# Altium schematic sheet Audio.SchDoc: Audio
size A4; CompanyName: STMicroelectronics; Organization: Microcontrollers Division; DocumentNumber: 6; SheetNumber: 13; SheetTotal: 19
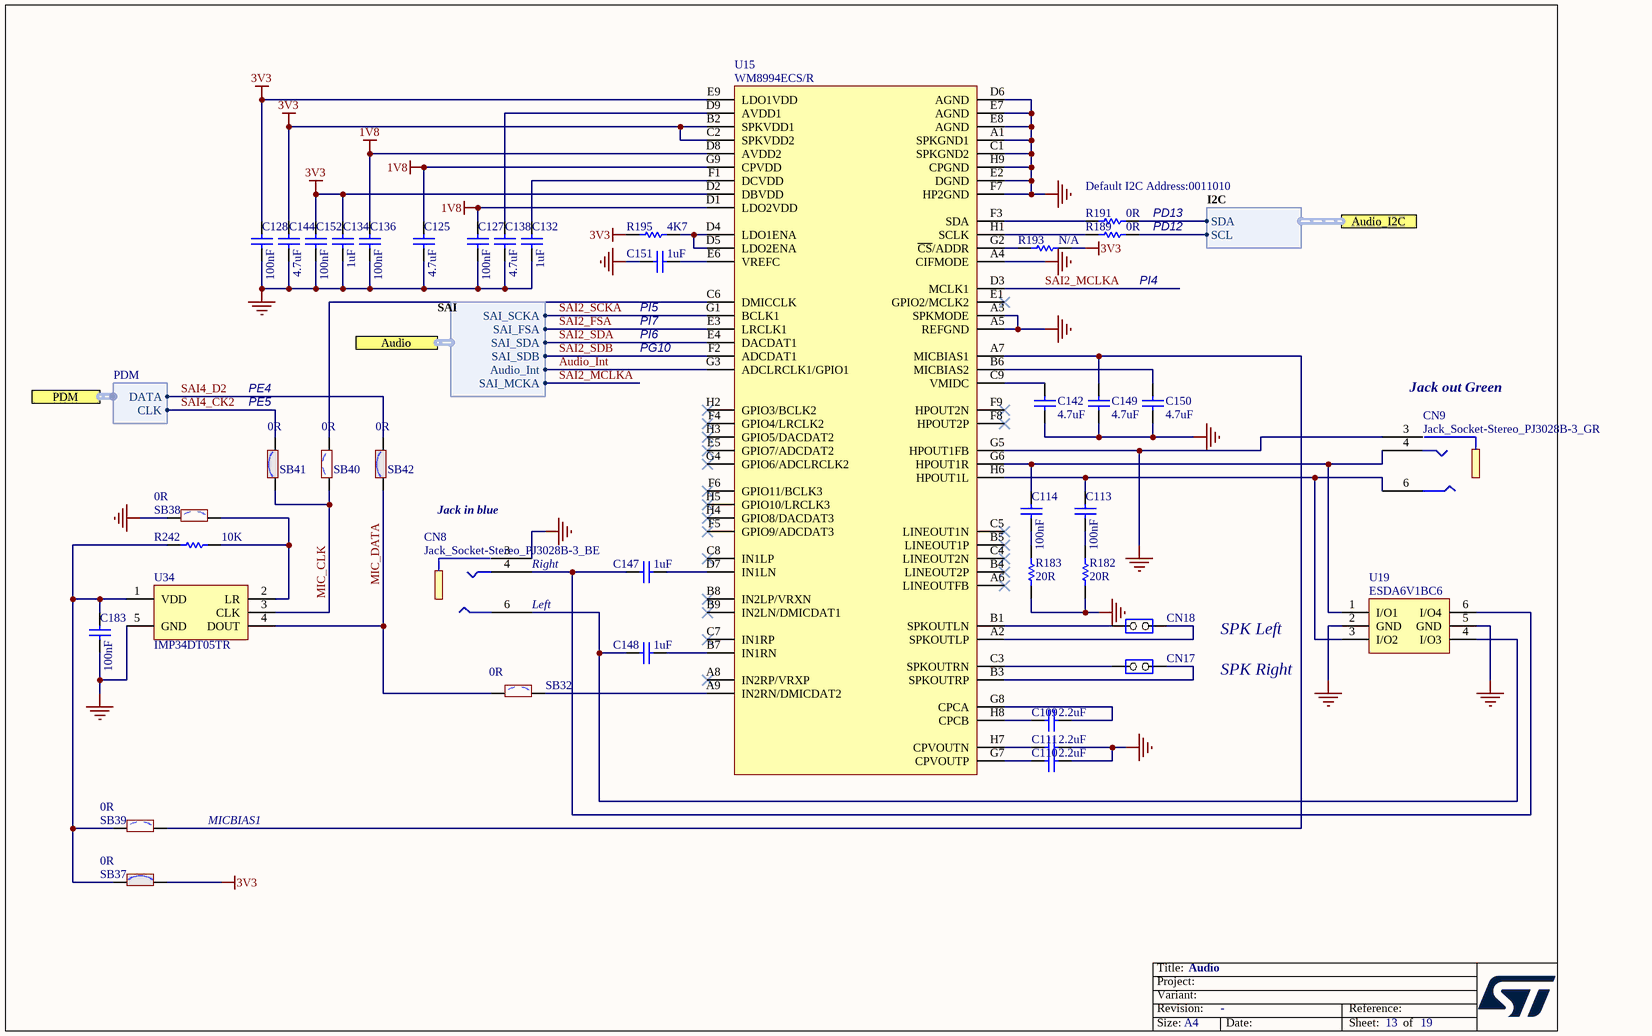
[diagram p0: Audio.SchDoc]

## Parts
C109  value 2.2uF  [C0603]  (hidden comment: Capacitor)
C110  value 2.2uF  [C0603]  (hidden comment: Capacitor)
C111  value 2.2uF  [C0603]  (hidden comment: Capacitor)
C113  value 100nF  [C0402]  (hidden comment: Capacitor)
C114  value 100nF  [C0402]  (hidden comment: Capacitor)
C125  value 4.7uF  [C0603]  (hidden comment: Capacitor)
C127  value 100nF  [C0402]  (hidden comment: Capacitor)
C128  value 100nF  [C0402]  (hidden comment: Capacitor)
C132  value 1uF  [C0603]  (hidden comment: Capacitor)
C134  value 1uF  [C0603]  (hidden comment: Capacitor)
C136  value 100nF  [C0402]  (hidden comment: Capacitor)
C138  value 4.7uF  [C0603]  (hidden comment: Capacitor)
C142  value 4.7uF  [C0603]  (hidden comment: Capacitor)
C144  value 4.7uF  [C0603]  (hidden comment: Capacitor)
C147  value 1uF  [C0603]  (hidden comment: Capacitor)
C148  value 1uF  [C0603]  (hidden comment: Capacitor)
C149  value 4.7uF  [C0603]  (hidden comment: Capacitor)
C150  value 4.7uF  [C0603]  (hidden comment: Capacitor)
C151  value 1uF  [C0603]  (hidden comment: Capacitor)
C152  value 100nF  [C0402]  (hidden comment: Capacitor)
C183  value 100nF  [C0402]  (hidden comment: Capacitor)
CN8  value Jack_Socket-Stereo_PJ3028B-3_BE  [CON_PHONE-JACK-3P5_HY_PJ3028B]  (hidden comment: Jack_PJ3028B-3_3P)
CN9  value Jack_Socket-Stereo_PJ3028B-3_GR  [CON_PHONE-JACK-3P5_HY_PJ3028B]  (hidden comment: Jack_PJ3028B-3_3P)
CN17  Jumper Header 2x1  [CON_SAMTEC_TSW-102-07-G-S]  (value not drawn)
CN18  Jumper Header 2x1  [CON_SAMTEC_TSW-102-07-G-S]  (value not drawn)
R182  value 20R  [R0603]  (hidden comment: Resistor)
R183  value 20R  [R0603]  (hidden comment: Resistor)
R189  value 0R  [R0603]  (hidden comment: Resistor)
R191  value 0R  [R0603]  (hidden comment: Resistor)
R193  N/A  [R0402]
R195  value 4K7  [R0603]  (hidden comment: Resistor)
R242  value 10K  [R0402]  (hidden comment: Resistor)
SB32  value 0R  [SOLDER-BRIDGE_R0603-0R]  (hidden comment: SB_OFF)
SB37  value 0R  [SOLDER-BRIDGE_R0603-0R]  (hidden comment: SB_ON)
SB38  value 0R  [SOLDER-BRIDGE_R0603-0R]  (hidden comment: SB_OFF)
SB39  value 0R  [SOLDER-BRIDGE_R0603-0R]  (hidden comment: SB_OFF)
SB40  value 0R  [SOLDER-BRIDGE_R0603-0R]  (hidden comment: SB_OFF)
SB41  value 0R  [SOLDER-BRIDGE_R0603-0R]  (hidden comment: SB_ON)
SB42  value 0R  [SOLDER-BRIDGE_R0603-0R]  (hidden comment: SB_ON)
U15  WM8994ECS/R  [ICC_W-CSP-BGA72_4P511X4P023_P050]
U19  ESDA6V1BC6  [ESD_SOT23-6L]
U34  IMP34DT05TR  [MIC_HCLGA_3X4X1_4LD]

## Ports
Audio (harness SAI), Audio_I2C (harness I2C), PDM (harness PDM)

## Harnesses
SAI: SAI_SDB, SAI_FSA, Audio_Int, SAI_SDA, SAI_SCKA, SAI_MCKA
I2C: SDA, SCL
PDM: DATA, CLK

## Nets
1V8: C125.2 C127.1 C136.1 U15.D1(LDO2VDD) U15.D8(AVDD2) U15.G9(CPVDD)
3V3: C128.1 C134.2 C144.2 C152.1 R193.1 R195.1 SB37.2 U15.B2(SPKVDD1) U15.C2(SPKVDD2) U15.D2(DBVDD) U15.E9(LDO1VDD)
GND: C110.1 C111.1 C125.1 C127.2 C128.2 C132.1 C134.1 C136.2 C138.1 C142.1 C144.1 C149.1 C150.1 C151.2 C152.2 C183.2 CN8.3 CN9.3 R182.1 R183.1 SB38.1 U15.A1(SPKGND1) U15.A3(SPKMODE) U15.A4(CIFMODE) U15.A5(REFGND) U15.C1(SPKGND2) U15.D6(AGND) U15.E2(DGND) U15.E7(AGND) U15.E8(AGND) U15.F7(HP2GND) U15.G5(HPOUT1FB) U15.H9(CPGND) U19.2(GND) U19.5(GND) U34.5(GND)
Audio_Int: U15.G3(ADCLRCLK1/GPIO1) ; port Audio.Audio_Int
MIC_CLK: SB40.1 SB41.1 U34.3(CLK)
MIC_DATA: SB32.1 SB42.1 U34.4(DOUT)
SAI2_FSA: U15.E3(LRCLK1) ; port Audio.SAI_FSA
SAI2_MCLKA: U15.D3(MCLK1) ; port Audio.SAI_MCKA
SAI2_SCKA: U15.G1(BCLK1) ; port Audio.SAI_SCKA
SAI2_SDA: U15.E4(DACDAT1) ; port Audio.SAI_SDA
SAI2_SDB: U15.F2(ADCDAT1) ; port Audio.SAI_SDB
SAI4_CK2: SB41.2 ; port PDM.CLK
SAI4_D2: SB42.2 ; port PDM.DATA
NetC109_1: C109.1 U15.G8(CPCA)
NetC109_2: C109.2 U15.H8(CPCB)
NetC110_2: C110.2 U15.G7(CPVOUTP)
NetC111_2: C111.2 U15.H7(CPVOUTN)
NetC113_1: C113.1 CN9.6 U15.H6(HPOUT1L) U19.3(I/O2)
NetC113_2: C113.2 R182.2
NetC114_1: C114.1 CN9.4 U15.G6(HPOUT1R) U19.1(I/O1)
NetC114_2: C114.2 R183.2
NetC132_2: C132.2 U15.F1(DCVDD)
NetC138_2: C138.2 U15.D9(AVDD1)
NetC142_2: C142.2 U15.C9(VMIDC)
NetC147_1: C147.1 U15.D7(IN1LN)
NetC147_2: C147.2 CN8.4 U19.6(I/O4)
NetC148_1: C148.1 U15.B7(IN1RN)
NetC148_2: C148.2 CN8.6 U19.4(I/O3)
NetC149_2: C149.2 SB39.2 U15.A7(MICBIAS1)
NetC150_2: C150.2 U15.B6(MICBIAS2)
NetC151_1: C151.1 U15.E6(VREFC)
NetC183_1: C183.1 R242.2 SB37.1 SB39.1 U34.1(VDD)
NetCN17_1: CN17.1(COMMON) U15.B3(SPKOUTRP)
NetCN17_2: CN17.2(NO) U15.C3(SPKOUTRN)
NetCN18_1: CN18.1(COMMON) U15.A2(SPKOUTLP)
NetCN18_2: CN18.2(NO) U15.B1(SPKOUTLN)
NetR189_1: R189.1 U15.H1(SCLK)
NetR189_2: R189.2 ; port Audio_I2C.SCL
NetR191_1: R191.1 U15.F3(SDA)
NetR191_2: R191.2 ; port Audio_I2C.SDA
NetR193_2: R193.2 U15.G2(~{CS}/ADDR)
NetR195_2: R195.2 U15.D4(LDO1ENA) U15.D5(LDO2ENA)
NetR242_1: R242.1 SB38.2 U34.2(LR)
NetSB32_2: SB32.2 U15.A9(IN2RN/DMICDAT2)
NetSB40_2: SB40.2 U15.C6(DMICCLK)

Not connected (* = marked no-connect by the designer): U15 A6(LINEOUTFB)* A8(IN2RP/VRXP)* B4(LINEOUT2P)* B5(LINEOUT1P)* B8(IN2LP/VRXN)* B9(IN2LN/DMICDAT1)* C4(LINEOUT2N)* C5(LINEOUT1N)* C7(IN1RP)* C8(IN1LP)* E1(GPIO2/MCLK2)* E5(GPIO7/ADCDAT2)* F4(GPIO4/LRCLK2)* F5(GPIO9/ADCDAT3)* F6(GPIO11/BCLK3)* F8(HPOUT2P)* F9(HPOUT2N)* G4(GPIO6/ADCLRCLK2)* H2(GPIO3/BCLK2)* H3(GPIO5/DACDAT2)* H4(GPIO8/DACDAT3)* H5(GPIO10/LRCLK3)*

## Notes on the sheet
- Default I2C Address:0011010
- PD13
- PD12
- (near C151) PI5
- PI4
- PG10
- PI6
- PI7
- PE4
- (near SB41) PE5
- (near CN9) Jack out Green
- Jack in blue
- (near CN8) Right
- (near CN8) Left
- SPK Left
- SPK Right
- MICBIAS1
- Title:
- Project:
- Size:
- Revision:
- Variant:
- A4
- -
- Date:
- Reference:
- Sheet:
- of

## Library data of the parts
C109-C111 = MCD-00012: Capacitor, MLCC, 2.2uF, 10V, X5R, 10%, 0603, T=0,8mm; Manufacturer_Part_Number: CC0603KRX5R6BB225; Manufacturer: YAGEO; Alternate_Manufacturer_Part_Number: C0603C225K8PACTU; Alternate_Manufacturer: KEMET; BMS_Part_Number: 9142010; Part_Preference: Recommended; Partial_Alternate_Internal_Part_Number: MCD-00551; Provided_By: Subcon; Initial_Board_Reference: MB1274; Component_Country_Of_Origin: China; ID: 2467; Order_Code_RS: 2370679; ShowFields: YES; Internal_Part_Number: MCD-00012; Status: Released; Part_Type: Capacitor; Package: 0603; ComponentLink1Description: Yageo_Capacitor_X5R-series.pdf; ComponentLink1URL: http://tunmcdsvn.tun.st.com/Component_Documentation_Library/Trunk/Capacitor/YAGEO_X5R_Series; ECCN_US: n/a; ECCN_EU: n/a; Order_Code_Digikey: 311-1451-1-ND; Order_Code_Farnell: 2370679
C113 C114 C127 C128 C136 C152 C183 = MCD-00006: Capacitor, MLCC, 100nF, 16V, X7R, +/-10%, 0402, T=0.5mm; Manufacturer_Part_Number: CC0402KRX7R7BB104; Manufacturer: YAGEO; Part_Preference: Recommended; Partial_Alternate_Internal_Part_Number: MCD-03299; Component_Country_Of_Origin: China; ID: 2474; Order_Code_RS: 9402047; ShowFields: YES; Internal_Part_Number: MCD-00006; Status: Released; Part_Type: Capacitor; Package: 0402; ComponentLink1URL: http://tunmcdsvn.tun.st.com/Component_Documentation_Library/Trunk/Capacitor/YAGEO_X7R_Series; Order_Code_Digikey: 311-1338-1-ND; Order_Code_Farnell: 9402047
C125 C138 C142 C144 C149 C150 = MCD-00009: Capacitor, MLCC, 4.7uF, 16V, X5R, 10%, 0603, T=0.8mm; Manufacturer_Part_Number: CC0603KRX5R7BB475; Manufacturer: YAGEO; Part_Preference: Recommended; Partial_Alternate_Internal_Part_Number: MCD-03565; Provided_By: subcon; Initial_Board_Reference: mb1274; Alternate_EMS: A; Component_Country_Of_Origin: China; ID: 2471; ShowFields: YES; Internal_Part_Number: MCD-00009; Status: Released; Part_Type: Capacitor; Package: 0603; ComponentLink1Description: Yageo_Capacitor_X5R-series.pdf; ComponentLink1URL: http://tunmcdsvn.tun.st.com/Component_Documentation_Library/Trunk/Capacitor/YAGEO_X5R_Series; ECCN_US: n/a; ECCN_EU: n/a; Order_Code_Digikey: 311-1785-1-ND; Order_Code_Farnell: N/A; Order_Code_RS: N/A
C132 C134 C147 C148 C151 = MCD-00010: Capacitor, MLCC, 1uF, 16V, X5R, 10%, 0603, T=0,8mm; Manufacturer_Part_Number: CC0603KRX5R7BB105; Manufacturer: YAGEO; Part_Preference: Recommended; Provided_By: Subcon; Initial_Board_Reference: mb1274; Component_Country_Of_Origin: China; ID: 2470; Order_Code_RS: 2370680; ShowFields: YES; Internal_Part_Number: MCD-00010; Status: Released; Part_Type: Capacitor; Package: 0603; ComponentLink1Description: Yageo_Capacitor_X5R-series.pdf; ComponentLink1URL: http://tunmcdsvn.tun.st.com/Component_Documentation_Library/Trunk/Capacitor/YAGEO_X5R_Series; ECCN_US: n/a; ECCN_EU: n/a; Order_Code_Digikey: 311-1444-1-ND; Order_Code_Farnell: 2370680
CN8 = MCD-00682: Connector Jack socket Stereo 3.5mm, 3 pins, RA, SMT, Blue (Line input); Manufacturer_Part_Number: PJ3028B-3_BE; Manufacturer: QIAOD; Alternate_Manufacturer_Part_Number: PJ30280-3_BE; Part_Preference: Recommended; Provided_By: Subcon; Initial_Board_Reference: MB1260; Component_Country_Of_Origin: Unknown; ID: 3061; ShowFields: YES; Internal_Part_Number: MCD-00682; Status: Checked; Part_Type: Connector; Alternate_Manufacturer: QIAOD; ComponentLink1Description: QIAOD_PJ-3028B-3-XX.pdf; ComponentLink1URL: http://tunmcdsvn.tun.st.com/Component_Documentation_Library/Trunk/Connector/QIAOD_PJ3028B-3_Series/; ECCN_US: n/a; ECCN_EU: n/a; Order_Code_Digikey: N/A; Order_Code_Farnell: N/A; Order_Code_RS: N/A
CN9 = MCD-00018: Connector Jack socket Stereo 3.5mm, 3 pins, RA, SMT, Green (Line output); Manufacturer_Part_Number: PJ3028B-3_GR; Manufacturer: QIAOD; Alternate_Manufacturer_Part_Number: PJ30280-3_GR; Part_Preference: Recommended; Provided_By: Subcon; Initial_Board_Reference: MB1274; Component_Country_Of_Origin: Unknown; ID: 2498; ShowFields: YES; Internal_Part_Number: MCD-00018; Status: Released; Part_Type: Connector; Alternate_Manufacturer: QIAOD; ComponentLink1Description: QIAOD_PJ-3028B-3-XX.pdf; ComponentLink1URL: http://tunmcdsvn.tun.st.com/Component_Documentation_Library/Trunk/Connector/QIAOD_PJ3028B-3_Series/; ECCN_US: n/a; ECCN_EU: n/a; Order_Code_Digikey: N/A; Order_Code_Farnell: N/A; Order_Code_RS: N/A
CN17 CN18 = MCD-00045: Header, 2x1, 2,54mm, VR, TH, Height 5.84mm/2.54mm; Part_Type: Connector; Manufacturer_Part_Number: TSW-102-07-G-S; Manufacturer: SAMTEC; Full_Alternate_Internal_Part_Number: MCD-02390; Part_Preference: Recommended; Partial_Alternate_Internal_Part_Number: MCD-02957, MCD-03720, MCD-04249; Provided_By: Subcon; Initial_Board_Reference: mb1274; Component_Country_Of_Origin: China, Costa Rica, Malaysia, USA, Vietnam; ID: 2545; Order_Code_RS: 2505044; ShowFields: YES; Internal_Part_Number: MCD-00045; Value: Header 2x1; Status: Released; ComponentLink1Description: Samtec_connector_TSW-HTSW-series.pdf; ComponentLink1URL: http://tunmcdsvn.tun.st.com/Component_Documentation_Library/Trunk/Connector/SAMTEC_TSW_Series/; ECCN_US: n/a; ECCN_EU: n/a; Order_Code_Digikey: SAM1029-02-ND; Order_Code_Farnell: 2505044
R182 R183 = MCD-00345: Resistor,20R,0603,1%,1/10W; Manufacturer_Part_Number: RC0603FR-0720RL; Manufacturer: YAGEO; Part_Preference: Recommended; Provided_By: Subcon; Component_Country_Of_Origin: China; ID: 2933; ShowFields: YES; Internal_Part_Number: MCD-00345; Status: Released; Part_Type: Resistor; Package: 0603; ComponentLink1Description: Yageo_Resistor_RC0603-series.pdf; ComponentLink1URL: http://tunmcdsvn.tun.st.com/Component_Documentation_Library/Trunk/Resistor/YAGEO_RC_L_Series; ECCN_US: n/a; ECCN_EU: n/a; Order_Code_Digikey: 311-20.0HRCT-ND; Order_Code_Farnell: 1799333; Order_Code_RS: N/A
R189 R191 = MCD-00181: Resistor,0R,0603,ULO; Manufacturer_Part_Number: PMR03EZPJ000; Manufacturer: ROHM SEMICONDUCTOR; Part_Preference: Recommended; Provided_By: Subcon; Component_Country_Of_Origin: Philippines, Thailand°°; ID: 2691; ShowFields: YES; Internal_Part_Number: MCD-00181; Status: Released; Part_Type: Resistor; Package: 0603; ComponentLink1Description: ROHM_ULtra low Ohmic Resistor _PMR10EZPJ000.pdf; ComponentLink1URL: http://tunmcdsvn.tun.st.com/Component_Documentation_Library/Trunk/Resistor/ROHM_PMR_Series; ECCN_US: n/a; ECCN_EU: n/a; Order_Code_Digikey: PMR03EZPJ000-ND; Order_Code_Farnell: N/A; Order_Code_RS: N/A
R193 R242 = MCD-00053: Resistor,10K,0402,1%,1/16W; Manufacturer_Part_Number: RC0402FR-0710KL; Manufacturer: YAGEO; BMS_Part_Number: 9131590; Part_Preference: Recommended; Provided_By: subcon; Initial_Board_Reference: MB1274; Component_Country_Of_Origin: China; ID: 2539; Order_Code_RS: 9239359; ShowFields: YES; Internal_Part_Number: MCD-00053; Status: Released; Part_Type: Resistor; Package: 0402; ComponentLink1Description: Yageo_Resistor_RC0402-series.pdf; ComponentLink1URL: http://tunmcdsvn.tun.st.com/Component_Documentation_Library/Trunk/Resistor/YAGEO_RC_L_Series; ECCN_US: n/a; ECCN_EU: n/a; Order_Code_Digikey: 311-10.0KLRCT-ND; Order_Code_Farnell: 9239359
  R193: Value: 10K
R195 = MCD-00219: Resistor,4K7,0603,1%,1/10W; Manufacturer_Part_Number: RC0603FR-074K7L; Manufacturer: YAGEO; Part_Preference: Recommended; Provided_By: Subcon; Initial_Board_Reference: mb1319; Component_Country_Of_Origin: China; ID: 2648; ShowFields: YES; Internal_Part_Number: MCD-00219; Status: Released; Part_Type: Resistor; Package: 0603; ComponentLink1Description: Yageo_Resistor_RC0603-series.pdf; ComponentLink1URL: http://tunmcdsvn.tun.st.com/Component_Documentation_Library/Trunk/Resistor/YAGEO_RC_L_Series; ECCN_US: n/a; ECCN_EU: n/a; Order_Code_Digikey: 311-4.70KHRCT-ND; Order_Code_Farnell: 9238565; Order_Code_RS: N/A
SB32 SB38-SB40 = MCD-00072: Solder Bridge OFF; Part_Type: Resistor; Manufacturer: YAGEO; Manufacturer_HQ_COO: Unknown; Manufacturer_Part_Number: RC0603JR-070RL; Part_Preference: Recommended; Initial_Board_Reference: mb1274; Component_Country_Of_Origin: China; ID: 2520; Order_Code_RS: 199-5647; ShowFields: YES; Internal_Part_Number: MCD-00072; Status: Released; ECCN_US: n/a; ECCN_EU: n/a; Provided_By: n/a; ComponentLink1URL: http://tunmcdsvn.tun.st.com/Component_Documentation_Library/Trunk/Resistor/YAGEO_RC_Series; Order_Code_Digikey: 311-0.0GRTR-ND; Order_Code_Farnell: 2421846; Package: 0603
SB37 SB41 SB42 = MCD-00071: Solder Bridge ON; Part_Type: Resistor; Manufacturer: YAGEO; Manufacturer_HQ_COO: Unknown; Manufacturer_Part_Number: RC0603JR-070RL; Part_Preference: Recommended; Provided_By: Subcon; Initial_Board_Reference: mb1274; Component_Country_Of_Origin: China; ID: 2521; Order_Code_RS: 199-5647; ShowFields: YES; Internal_Part_Number: MCD-00071; ECCN_US: n/a; ECCN_EU: n/a; Status: Released; ComponentLink1URL: http://tunmcdsvn.tun.st.com/Component_Documentation_Library/Trunk/Resistor/YAGEO_RC_Series; Order_Code_Digikey: 311-0.0GRTR-ND; Order_Code_Farnell: 2421846; Package: 0603
U15 = MCD-00079: Multi-Channel Audio Hub CODEC for Smartphones; Part_Type: IC; Manufacturer: CIRRUS LOGIC; Part_Preference: Recommended; ECCN_US: EAR99; ECCN_EU: NEC; Provided_By: Subcon; Initial_Board_Reference: MB1274; Component_Country_Of_Origin: China; ID: 2513; ShowFields: YES; Internal_Part_Number: MCD-00079; Value: WM8994ECS/R; Status: Released; Manufacturer_Part_Number: WM8994ECS/R; ComponentLink1Description: Wolfson_audio-codec_WM8994_ProductBrief_v4.1.pdf; ComponentLink1URL: http://tunmcdsvn.tun.st.com/Component_Documentation_Library/Trunk/IC/CIRRUS_LOGIC_WM8994ECS_R; Order_Code_Digikey: WM8994ECS/RTR-ND; Order_Code_Farnell: N/A; Order_Code_RS: N/A; Package: WCSP-72
U19 = MCD-00247: Quad Bidir ESD protection; Part_Type: Diode; Manufacturer: STMICROELECTRONICS; BMS_Part_Number: 9179038; Manufacturer_HQ_COO: EU; Part_Preference: Recommended; ECCN_US: EAR99; ECCN_EU: NEC; Provided_By: Subcon; Initial_Board_Reference: MB1311; Component_Country_Of_Origin: China; ID: 2624; Order_Code_RS: 248-805; ShowFields: YES; Internal_Part_Number: MCD-00247; Value: ESDA6V1BC6; Status: Released; Manufacturer_Part_Number: ESDA6V1BC6; ComponentLink1Description: ST_ESDA6V1BC6.pdf; ComponentLink1URL: http://tunmcdsvn.tun.st.com/Component_Documentation_Library/Trunk/Diode/STMICROELECTRONICS_ESDA6V1BC6; Order_Code_Digikey: 497-6635-2-ND; Order_Code_Farnell: 2353644; Package: SOT23-6
U34 = MCD-01715: MEMS audio sensor omnidirectional digital microphone for industrial applications; BMS_Part_Number: 9177995; Part_Type: IC; Part_Preference: Recommended; Manufacturer: STMICROELECTRONICS; Manufacturer_HQ_COO: EU; Component_Country_Of_Origin: Philippines; ShowFields: YES; ID: 3815; Order_Code_RS: 193-5449; Internal_Part_Number: MCD-01715; Value: IMP34DT05TR; Status: Released; Manufacturer_Part_Number: IMP34DT05TR; Package: HCLGA-4; ComponentLink1URL: http://tunmcdsvn.tun.st.com/Component_Documentation_Library/Trunk/IC/STMICROELECTRONICS_IMP34DT05TR; Order_Code_Digikey: 497-18183-2-ND; Order_Code_Farnell: 2980886